# Altium project MIXR Regulators.PrjPcb (part 2 of 2)

## Sheet MIXR Power - Battery Management System.SchDoc: Title
size B; Organization: Midnight Sun Solar Rayce Car Team; Address1: University of Waterloo; Address2: 200 University Ave W; Address3: Waterloo, ON, Canada; Address4: N2L 3E9; Website: www.uwmidsun.com; ProjectName: ProjectName
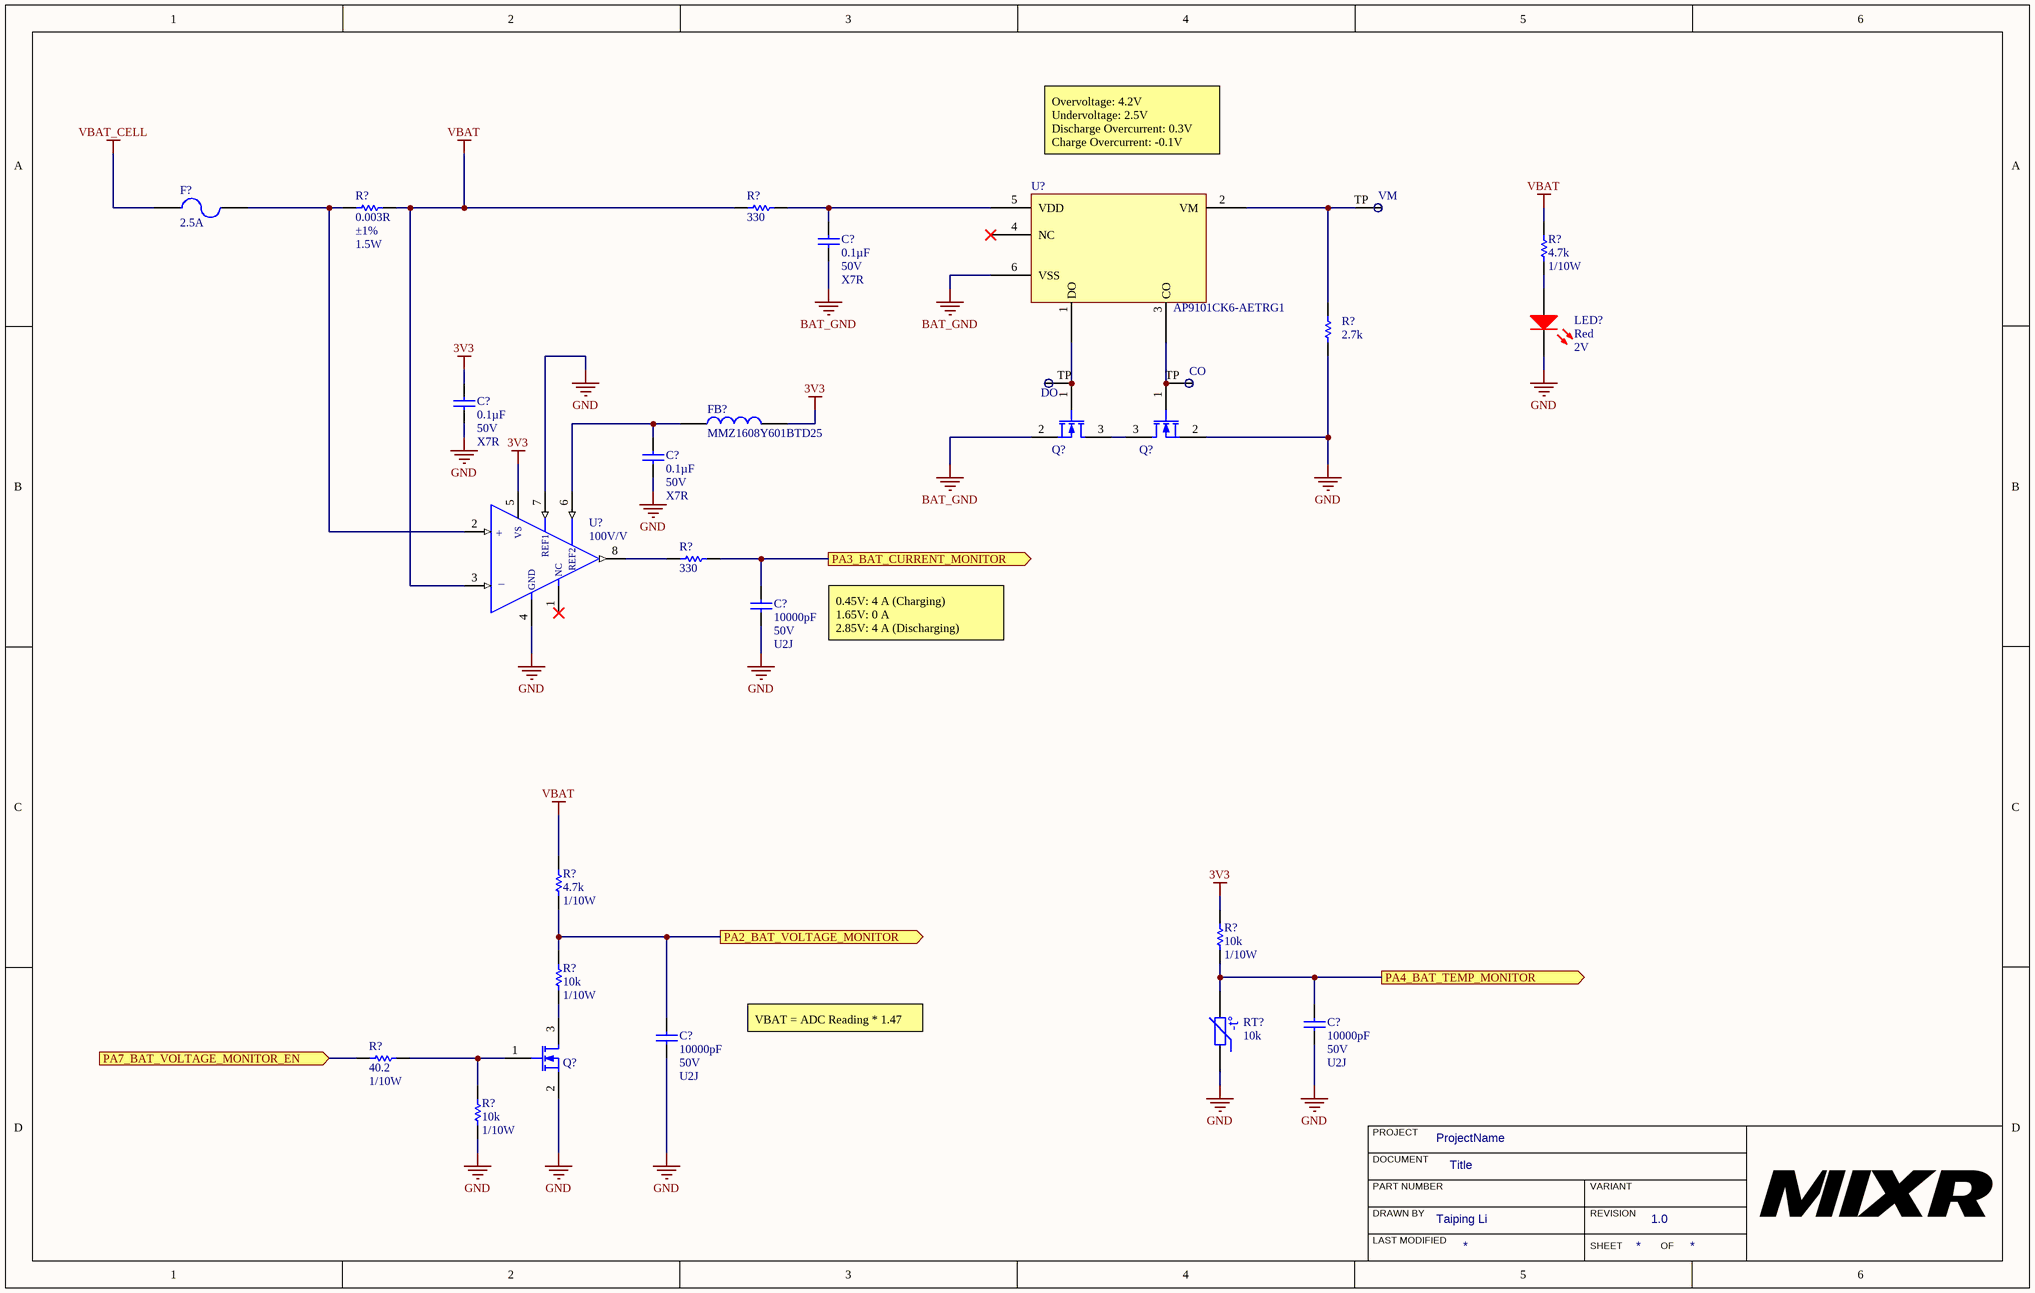
[diagram p2: MIXR Power - Battery Management System.SchDoc]

### Parts
(Parts that share a designator on the sheet are numbered #1, #2 ... from top to bottom, then left to right.)
C?#7  Capacitance: 0.1µF  Voltage: 50V  Temperature Coefficient: X7R  [CAP, 0603]  (hidden comment: CAP CER 0.1UF 50V 10% X7R 0603)
C?#8  Capacitance: 0.1µF  Voltage: 50V  Temperature Coefficient: X7R  [CAP, 0603]  (hidden comment: CAP CER 0.1UF 50V 10% X7R 0603)
C?#9  Capacitance: 0.1µF  Voltage: 50V  Temperature Coefficient: X7R  [CAP, 0603]  (hidden comment: CAP CER 0.1UF 50V 10% X7R 0603)
C?#10  Capacitance: 10000pF  Voltage: 50V  Temperature Coefficient: U2J  [CAP, 0603]  (hidden comment: CAP CER 10nF 50V 5% X7R 0603)
C?#11  Capacitance: 10000pF  Voltage: 50V  Temperature Coefficient: U2J  [CAP, 0603]  (hidden comment: CAP CER 10nF 50V 5% X7R 0603)
C?#12  Capacitance: 10000pF  Voltage: 50V  Temperature Coefficient: U2J  [CAP, 0603]  (hidden comment: CAP CER 10nF 50V 5% X7R 0603)
CO  Test Point  [Test Point]  (value not drawn)  (no BOM)
DO  Test Point  [Test Point]  (value not drawn)  (no BOM)
F?  Current Rating: 2.5A  [FUSE LITTLEFUSE 0466 1206]  (hidden comment: FUSE 2.5A 32VDC 1206)
FB?  Manufacturer Part Number: MMZ1608Y601BTD25  [FB 0603]  (hidden comment: FB 600 OHM 1LN 0603)
LED?  Color: Red  Voltage - Forward (Vf) (Typ): 2V  [LED_0603]  (hidden comment: LED RED CLEAR 2V 0603)
Q?#1  MOSFET N-CH 30V 6.2A 0.9W SOT-23  [MOSFET N-CH 30V 6.2A 0.9W SOT-23]  (value not drawn)
Q?#2  MOSFET N-CH 30V 6.2A 0.9W SOT-23  [MOSFET N-CH 30V 6.2A 0.9W SOT-23]  (value not drawn)
Q?#3  MOSFET N-CH 30V 6.2A 0.9W SOT-23  [MOSFET N-CH 30V 6.2A 0.9W SOT-23]  (value not drawn)
R?#7  Resistance (Ohms): 0.003R  Tolerance: ±1%  Power (Watts): 1.5W  [RES 2010]  (hidden comment: RES 0.003 OHM 1% 1.5W 2010)
R?#8  value 330  [RES, 0603]  (hidden comment: RES 330 OHM 1% 1/10W 0603)
R?#9  Resistance (Ohms): 4.7k  Power (Watts): 1/10W  [RES, 0603]  (hidden comment: RES 4.7K OHM 1% 1/10W 0603)
R?#10  2.7k  [RES, 0603]
R?#11  value 330  [RES, 0603]  (hidden comment: RES 330 OHM 1% 1/10W 0603)
R?#12  Resistance (Ohms): 4.7k  Power (Watts): 1/10W  [RES, 0603]  (hidden comment: RES 4.7K OHM 1% 1/10W 0603)
R?#13  Resistance: 10k  Power: 1/10W  [RES, 0603]  (hidden comment: RES 10K OHM 1% 1/10W 0603)
R?#14  Resistance: 10k  Power: 1/10W  [RES, 0603]  (hidden comment: RES 10K OHM 1% 1/10W 0603)
R?#15  Resistance: 40.2  Power: 1/10W  [RES, 0603]  (hidden comment: RES 40.2 OHM 0.5% 1/10W 0603)
R?#16  Resistance: 10k  Power: 1/10W  [RES, 0603]  (hidden comment: RES 10K OHM 1% 1/10W 0603)
RT?  Resistance in Ohms @ 25°C: 10k  [RES, 0603]  (hidden comment: NTC THERMISTORS 10K 0603 SMD)
U?#3  Manufacturer Part Number: AP9101CK6-AETRG1  [SOT23-6]  (hidden comment: IC BATT PROT LI-ION 1-CELL SOT26)
U?#4  100V/V  [IC CURRENT AMPLIFIER INA240 TSSOP-8]
VM  Test Point  [Test Point]  (value not drawn)  (no BOM)

### Ports
PA2_BAT_VOLTAGE_MONITOR (out), PA3_BAT_CURRENT_MONITOR (out), PA4_BAT_TEMP_MONITOR (out), PA7_BAT_VOLTAGE_MONITOR_EN (in)

### Nets
3V3: C?#8.1 FB?.2 R?#13.1 U?#4.5(VS)
BAT_GND: C?#7.2 Q?#1.2(S) U?#3.6(VSS)
GND: C?#8.2 C?#9.2 C?#10.2 C?#11.2 C?#12.2 LED?.2(K) Q?#2.2(S) Q?#3.2(S) R?#10.2 R?#16.2 RT?.1 U?#4.4(GND) U?#4.7(REF1)
VBAT: R?#7.2 R?#8.1 R?#9.1 R?#12.1 U?#4.3(-IN)
VBAT_CELL: F?.1
NetC?#7_1: C?#7.1 R?#8.2 U?#3.5(VDD)
NetC?#9_1: C?#9.1 FB?.1 U?#4.6(REF2)
NetC?#10_1: C?#10.1 R?#11.2 ; port PA3_BAT_CURRENT_MONITOR
NetC?#11_1: C?#11.1 R?#13.2 RT?.2 ; port PA4_BAT_TEMP_MONITOR
NetC?#12_1: C?#12.1 R?#12.2 R?#14.1 ; port PA2_BAT_VOLTAGE_MONITOR
NetCO_TP: CO.TP Q?#2.1(G) U?#3.3(CO)
NetDO_TP: DO.TP Q?#1.1(G) U?#3.1(DO)
NetF?_2: F?.2 R?#7.1 U?#4.2(+IN)
NetLED?_1: LED?.1(A) R?#9.2
NetQ?#1_3: Q?#1.3(D) Q?#2.3(D)
NetQ?#3_1: Q?#3.1(G) R?#15.2 R?#16.1
NetQ?#3_3: Q?#3.3(D) R?#14.2
NetR?#10_1: R?#10.1 U?#3.2(VM) VM.TP
NetR?#11_1: R?#11.1 U?#4.8(OUTPUT)
NetR?#15_1: R?#15.1 ; port PA7_BAT_VOLTAGE_MONITOR_EN

Not connected (* = marked no-connect by the designer): U?#3 4(NC)*; U?#4 1(NC)*

### Notes on the sheet
- Overvoltage: 4.2V
  Undervoltage: 2.5V
  Discharge Overcurrent: 0.3V
  Charge Overcurrent: -0.1V
- 0.45V: 4 A (Charging)
  1.65V: 0 A
  2.85V: 4 A (Discharging)
- VBAT = ADC Reading * 1.47
- PROJECT
- DOCUMENT
- DRAWN BY
- LAST MODIFIED
- PART NUMBER
- REVISION
- SHEET
- VARIANT
- OF
- (in symbol IC CURRENT AMPLIFIER INA240 8-TSSOP) +; _
- (in symbol NTC THERMISTORS 10K 0603 SMD) -t°

### Library data of the parts
C?#7-C?#9 = CAP CER 0.1UF 50V 10% X7R 0603: 0.10µF ±10% 50V Ceramic Capacitor X7R 0603 (1608 Metric); Manufacturer 1: AVX Corporation; Manufacturer Part Number 1: 06035C104KAT2A; Supplier 1: Digi-Key; Supplier Part Number 1: 478-5052-1-ND; Packaging: Cut Tape (CT); Part Status: Active; Operating Temperature: -55°C ~ 125°C; Ratings: -; Mounting Type: Surface Mount, MLCC; Package / Case: 0603 (1608 Metric); Size / Dimension: 0.063" L x 0.032" W (1.60mm x 0.81mm); Height - Seated (Max): -; Thickness (Max): 0.035" (0.90mm); Lead Spacing: -; Lead Style: -; ComponentLink1URL: http://datasheets.avx.com/X7RDielectric.pdf; ComponentLink1Description: http://datasheets.avx.com/X7RDielectric.pdf; Tolerance: ±10%
C?#10-C?#12 = CAP CER 10nF 50V 5% X7R 0603: 10000pF ±5% 50V Ceramic Capacitor U2J 0603 (1608 Metric); Manufacturer 1: KEMET; Manufacturer Part Number 1: C0603C103J5JAC7867; Supplier 1: Digi-Key; Supplier Part Number 1: 399-13384-1-ND; Packaging: Cut Tape (CT); Part Status: Active; Operating Temperature: -55°C ~ 125°C; Ratings: -; Failure Rate: -; Mounting Type: Surface Mount, MLCC; Package / Case: 0603 (1608 Metric); Size / Dimension: 0.063" L x 0.032" W (1.60mm x 0.80mm); Height - Seated (Max): -; Thickness (Max): 0.034" (0.87mm); Lead Spacing: -; Lead Style: -; ComponentLink1URL: http://www.kemet.com/docfinder?Partnumber=C0603C103J5JAC7867; ComponentLink1Description: http://www.kemet.com/docfinder?Partnumber=C0603C103J5JAC7867; Tolerance: ±5%
F? = FUSE 2.5A 32VDC 1206: 2.5A 32V AC 32V DC Fuse Board Mount (Cartridge Style Excluded) Surface Mount 1206 (3216 Metric); Manufacturer 1: Littelfuse; Manufacturer Part Number 1: 046602.5NRHF; DC Cold Resistance: 24mR; Power Dissipation: 192.5mW; Approvals: UL; Supplier 1: Digi-Key; Stock 1: 4995; Pricing 1: 1=0.84000, 5=0.81200, 10=0.78700, 50=0.66180, 100=0.54930, 250=0.49940, 500=0.42450, 1000=0.37455 (USD); RoHS: Yes; Mount: Surface Mount; Case/Package: 1206; Case Code (Metric): 3216; Case Code (Imperial): 1206; Housing Material: Ceramic; Min Operating Temperature: -55°C; Max Operating Temperature: 90°C; Package Quantity: 5000; Voltage Rating (AC): 32V; Voltage Rating (DC): 32V; Packaging: Tape and Reel; Working Voltage: 32V; Fuse Type: Board Mount (Cartridge Style Excluded); Length: 3.18mm; Height: 0.023inch; Width: 0.06inch; Depth: 1.52mm; Lead Free: Lead Free; ComponentLink1URL: https://datasheet.ciiva.com/303/littelfuse-fuse-466-303217.pdf?src-supplier=Digi-Key; ComponentLink1Description: https://datasheet.ciiva.com/303/littelfuse-fuse-466-303217.pdf?src-supplier=Digi-Key; ComponentLink2URL: https://datasheet.ciiva.com/18652/littelfuse-fuse-466-datasheet-pdf-18652469.pdf?src-supplier=Digi-Key; ComponentLink2Description: https://datasheet.ciiva.com/18652/littelfuse-fuse-466-datasheet-pdf-18652469.pdf?src-supplier=Digi-Key; ComponentLink3URL: https://datasheet.ciiva.com/16327/littelfuse-fuse-466-16327471.pdf?src-supplier=Future+Electronics; ComponentLink3Description: https://datasheet.ciiva.com/16327/littelfuse-fuse-466-16327471.pdf?src-supplier=Future+Electronics; Supplier Part Number 1: F6143CT-ND
FB? = FB 600 OHM 1LN 0603: FERRITE BEAD 600 OHM 0603 1LN; Manufacturer: TDK; Number of Lines: 1; Max Current Rating: 500mA; DC Resistance (DCR): 400mR; Impedance: 600R; Tolerance: 25%; Test Frequency: 100MHz; Supplier 1: Digi-Key; Supplier Part Number 1: 445-172850-1-ND; RoHS: Yes; Stock 1: 19540; Pricing 1: 1 = 0.10000, 10 = 0.07600, 25 = 0.06840, 50 = 0.05000, 100 = 0.04330, 250 = 0.03416, 500 = 0.02884, 1000 = 0.02429 (USD); Mount: Surface Mount; Case/Package: 0603; Weight: 7.1E-05oz; Case Code (Metric): 1608; Case Code (Imperial): 0603; Min Operating Temperature: -55°C; Max Operating Temperature: 125°C; Package Quantity: 4000; Packaging: Tape and Reel; Termination: SMD/SMT; Max DC Current: 500mA; Length: 0.063inch; Height: 0.037inch; Width: 0.031inch; Ratings: AEC-Q200
LED? = LED RED CLEAR 2V 0603: Red 631nm LED Indication - Discrete 2V 0603 (1608 Metric); Manufacturer: Wurth Electronics Inc.; Manufacturer Part Number: 150060RS75000; Lens Color: Colorless; Millicandela Rating: 250mcd; Lens Style/Size: Rectangle with Flat Top, 1.10mm x 0.70mm; Current - Test: 20mA; Viewing Angle: 140°; Wavelength - Dominant: 625nm; Wavelength - Peak: 630nm; Supplier 1: Digi-Key; RoHS: RoHS Compliant; Category: Optoelectronics; Stock 1: 35521; Pricing 1: 1=0.21, 100=0.1617, 500=0.13964 (CAD); Packaging: Cut Tape (CT); Part Status: Active; Lens Transparency: Clear; Mounting Type: Surface Mount; Features: -; Package / Case: 0603 (1608 Metric); Supplier Device Package: 0603; Size / Dimension: 1.60mm L x 0.80mm W; Height (Max): 0.80mm; ComponentLink1URL: http://katalog.we-online.de/led/datasheet/150060RS75000.pdf; ComponentLink1Description: http://katalog.we-online.de/led/datasheet/150060RS75000.pdf; Supplier Part Number 1: 732-4978-1-ND
Q?#1-Q?#3 = MOSFET N-CH 30V 6.2A 0.9W SOT-23: N-Channel 30V 6.2A (Ta) 900mW (Ta) Surface Mount SOT-23; Manufacturer: Diodes; Manufacturer Part Number: DMN3023L-7; Rds On Max: 25mR; Input Capacitance: 873pF; Supplier 1: Digi-Key; Stock 1: 38246; Pricing 1: 1=0.47, 10=0.368, 100=0.2529, 500=0.1734, 1000=0.1301 (USD); Mount: Surface Mount; Case/Package: TO-236-3; Min Operating Temperature: -55°C; Max Operating Temperature: 150°C; Packaging: Tape and Reel; Drain to Source Voltage (Vdss): 30V; Continuous Drain Current (ID): 6.2A; Max Power Dissipation: 900mW; ComponentLink1URL: https://www.diodes.com/assets/Datasheets/DMN3023L.pdf; ComponentLink1Description: https://www.diodes.com/assets/Datasheets/DMN3023L.pdf; ComponentLink2URL: http://www.mouser.com/ds/2/115/DMN3023L-959533.pdf; ComponentLink2Description: http://www.mouser.com/ds/2/115/DMN3023L-959533.pdf; Supplier Part Number 1: DMN3023L-7DICT-ND
R?#7 = RES 0.003 OHM 1% 1.5W 2010: 0.003 Ohm ±1% 1.5W Chip Resistor 2010 (5025 Metric) Current Sense, Moisture Resistant Metal Foil; Manufacturer 1: Stackpole Electronics Inc.; Manufacturer Part Number 1: CSNL2010FT3L00; Description 1: RES SMD 0.003 OHM 1% 1.5W 2010; Temperature Coefficient: ±50ppm/°C; Supplier 1: Digi-Key; Supplier Part Number 1: CSNL2010FT3L00CT-ND; RoHS: RoHS Compliant; Category: Resistors; Stock 1: 18532; Pricing 1: 1=1.02, 10=0.844, 25=0.7232, 50=0.6508, 100=0.5665, 250=0.5062, 500=0.4098, 1000=0.33145 (CAD); Packaging: Cut Tape (CT); Part Status: Active; Composition: Metal Foil; Features: Current Sense, Moisture Resistant; Operating Temperature: -55°C ~ 170°C; Package / Case: 2010 (5025 Metric); Supplier Device Package: 2010; Size / Dimension: 0.200" L x 0.100" W (5.08mm x 2.54mm); Height - Seated (Max): 0.041" (1.04mm); Failure Rate: -; ComponentLink1URL: https://www.seielect.com/Catalog/SEI-csnl.pdf; ComponentLink1Description: https://www.seielect.com/Catalog/SEI-csnl.pdf
R?#8 R?#11 = RES 330 OHM 1% 1/10W 0603: 330 Ohms ±1% 0.1W, 1/10W Chip Resistor 0603 (1608 Metric) Automotive AEC-Q200, Moisture Resistant Thick Film; Manufacturer: TE Connectivity; Manufacturer Part Number: CRGCQ0603F330R; Supplier 1: Digi-Key; Supplier Part Number 1: A129682CT-ND; RoHS: No; Stock 1: 87700; Pricing 1: 1 = 0.10000, 10 = 0.03300, 100 = 0.01320, 1000 = 0.00595, 2500 = 0.00516 (USD); ComponentLink1URL: http://www.te.com/commerce/DocumentDelivery/DDEController?Action=srchrtrv&DocNm=1773204-3&DocType=DS&DocLang=English&src-supplier=Digi-Key; ComponentLink1Description: http://www.te.com/commerce/DocumentDelivery/DDEController?Action=srchrtrv&DocNm=1773204-3&DocType=DS&DocLang=English&src-supplier=Digi-Key; ComponentLink2URL: https://www.te.com/commerce/DocumentDelivery/DDEController?Action=srchrtrv&DocNm=1773204-3&DocType=DS&DocLang=English&src-supplier=Digi-Key; ComponentLink2Description: https://www.te.com/commerce/DocumentDelivery/DDEController?Action=srchrtrv&DocNm=1773204-3&DocType=DS&DocLang=English&src-supplier=Digi-Key
R?#9 R?#12 = RES 4.7K OHM 1% 1/10W 0603: 4.7k Ohm ±1% 0.1W, 1/10W Chip Resistor 0603 (1608 Metric) Moisture Resistant Thick Film; Manufacturer 1: Yageo; Manufacturer Part Number 1: RC0603FR-074K7L; Description 1: RES SMD 4.7K OHM 1% 1/10W 0603; Temperature Coefficient: ±100ppm/°C; Supplier 1: Digi-Key; Supplier Part Number 1: 311-4.70KHRCT-ND; RoHS: RoHS Compliant; Category: Resistors; Stock 1: 3487566; Pricing 1: 1=0.16, 10=0.022, 100=0.0089, 1000=0.00402, 2500=0.00349 (CAD); Packaging: Cut Tape (CT); Part Status: Active; Composition: Thick Film; Features: Moisture Resistant; Operating Temperature: -55°C ~ 155°C; Package / Case: 0603 (1608 Metric); Supplier Device Package: 0603; Size / Dimension: 0.063" L x 0.031" W (1.60mm x 0.80mm); Height - Seated (Max): 0.022" (0.55mm); Failure Rate: -; ComponentLink1URL: http://www.yageo.com/documents/recent/PYu-RC_Group_51_RoHS_L_7.pdf; ComponentLink1Description: http://www.yageo.com/documents/recent/PYu-RC_Group_51_RoHS_L_7.pdf; Tolerance: ±1%
R?#10 = RES 2.7K OHM 1% 1/10W 0603: 2.7 kOhms ±1% 0.1W, 1/10W Chip Resistor 0603 (1608 Metric) Automotive AEC-Q200, Moisture Resistant Thick Film; Manufacturer: TE Connectivity; Manufacturer Part Number: CRGCQ0603F2K7; Supplier 1: Digi-Key; Supplier Part Number 1: A129693CT-ND; RoHS: No; Stock 1: 137187; Pricing 1: 1 = 0.10000, 10 = 0.03300, 100 = 0.01320, 1000 = 0.00595, 2500 = 0.00516 (USD); ComponentLink1URL: http://www.te.com/commerce/DocumentDelivery/DDEController?Action=srchrtrv&DocNm=1773204-3&DocType=DS&DocLang=English&src-supplier=Digi-Key; ComponentLink1Description: http://www.te.com/commerce/DocumentDelivery/DDEController?Action=srchrtrv&DocNm=1773204-3&DocType=DS&DocLang=English&src-supplier=Digi-Key; ComponentLink2URL: https://www.te.com/commerce/DocumentDelivery/DDEController?Action=srchrtrv&DocNm=1773204-3&DocType=DS&DocLang=English&src-supplier=Digi-Key; ComponentLink2Description: https://www.te.com/commerce/DocumentDelivery/DDEController?Action=srchrtrv&DocNm=1773204-3&DocType=DS&DocLang=English&src-supplier=Digi-Key
R?#13 R?#14 R?#16 = RES 10K OHM 1% 1/10W 0603: RES SMD 10K OHM 1% 1/10W 0603; Manufacturer 1: Yageo; Manufacturer Part Number 1: RC0603FR-0710KL; Temperature Coefficient: ±100ppm/°C; Supplier 1: Digi-Key; Supplier Part Number 1: 311-10.0KHRCT-ND; Packaging: Cut Tape (CT); Part Status: Active; Composition: Thick Film; Operating Temperature: -55°C ~ 155°C; Package / Case: 0603 (1608 Metric); Supplier Device Package: 0603; Size / Dimension: 0.063" L x 0.031" W (1.60mm x 0.80mm); Height - Seated (Max): 0.022" (0.55mm); Failure Rate: -; ComponentLink1URL: http://www.yageo.com/documents/recent/PYu-RC_Group_51_RoHS_L_7.pdf; ComponentLink1Description: http://www.yageo.com/documents/recent/PYu-RC_Group_51_RoHS_L_7.pdf; Tolerance: ±1%
R?#15 = RES 40.2 OHM 0.5% 1/10W 0603: RES SMD 40.2 OHM 0.5% 1/10W 0603; Manufacturer 1: Yageo; Manufacturer Part Number 1: RT0603DRE0740R2L; Temperature Coefficient: ±50ppm/°C; Supplier 1: Digi-Key; Supplier Part Number 1: 311-2576-1-ND; Packaging: Cut Tape (CT); Part Status: Active; Composition: Thin Film; Operating Temperature: -55°C ~ 155°C; Package / Case: 0603 (1608 Metric); Supplier Device Package: 0603; Size / Dimension: 0.063" L x 0.031" W (1.60mm x 0.80mm); Height - Seated (Max): 0.022" (0.55mm); Failure Rate: -; ComponentLink1URL: http://www.yageo.com/documents/recent/PYu-RT_1-to-0.01_RoHS_L_7.pdf; ComponentLink1Description: http://www.yageo.com/documents/recent/PYu-RT_1-to-0.01_RoHS_L_7.pdf; Tolerance: ±0.5%
RT? = NTC THERMISTORS 10K 0603 SMD: NTC THERMISTORS 10KOHM 1608 SMD; Manufacturer: Murata Electronics North America; Manufacturer Part Number: NCU18XH103F60RB; Resistance Tolerance: ±1%; B25/50: 3380K; B25/85: 3434K; B25/100: 3455K; Supplier 1: Digi-Key; RoHS: Request Inventory Verification; Category: Sensors, Transducers; Stock 1: 0; Pricing 1: 4000=0.06771, 8000=0.05974, 12000=0.05775, 20000=0.05675, 28000=0.05576 (CAD); Packaging: Tape & Reel (TR); Part Status: Active; B Value Tolerance: ±1%; B0/50: -; B25/75: -; Operating Temperature: -40°C ~ 125°C; Length - Lead Wire: -; Mounting Type: Surface Mount; Package / Case: 0603 (1608 Metric); ComponentLink1URL: https://www.murata.com/~/media/webrenewal/support/library/catalog/products/thermistor/r03e.ashx; ComponentLink1Description: https://www.murata.com/~/media/webrenewal/support/library/catalog/products/thermistor/r03e.ashx; Supplier Part Number 1: 490-16279-2-ND
U?#3 = IC BATT PROT LI-ION 1-CELL SOT26: Battery Battery Protection IC Lithium Ion/Polymer SOT-26; Manufacturer: Diodes; Number of Cells: 1; Fault Protection: Over Current; Supplier 1: Digi-Key; Supplier Part Number 1: AP9101CK6-AETRG1DICT-ND; Stock 1: 5917; Pricing 1: 1 = 0.45000, 10 = 0.36300, 100 = 0.24720, 500 = 0.18540, 1000 = 0.13905 (USD); RoHS: Yes; Case/Package: SOT-23-6; Min Operating Temperature: -40°C; Max Operating Temperature: 85°C; ComponentLink1URL: https://www.diodes.com/assets/Datasheets/AP9101C.pdf?src-supplier=Digi-Key; ComponentLink1Description: https://www.diodes.com/assets/Datasheets/AP9101C.pdf?src-supplier=Digi-Key
U?#4 = IC CURRENT AMPLIFIER INA240 8-TSSOP: Current Sense Amplifier 1 Circuit 8-TSSOP; Manufacturer 1: Texas Instruments; Manufacturer Part Number 1: INA240A3PWR; Description 1: IC AMP CURRENT SENSE 8-TSSOP; Slew Rate: 2 V/µs; Current - Supply: 1.8mA; Voltage - Supply, Single/Dual (±): 2.7 V ~ 5.5 V; Supplier 1: Digi-Key; Supplier Part Number 1: 296-45090-1-ND; RoHS: RoHS Compliant; Category: Integrated Circuits (ICs); Stock 1: 1286; Pricing 1: 1=3.79, 10=3.397, 100=2.7311, 500=2.24388, 1000=1.85921 (CAD); Packaging: Cut Tape (CT); Part Status: Active; Amplifier Type: Current Sense; Output Type: -; Operating Temperature: -40°C ~ 125°C; Mounting Type: Surface Mount; Package / Case: 8-TSSOP (0.173", 4.40mm Width); Supplier Device Package: 8-TSSOP; ComponentLink1URL: http://www.ti.com/lit/ds/symlink/ina240.pdf; ComponentLink1Description: http://www.ti.com/lit/ds/symlink/ina240.pdf

## Nets that join several sheets
3V3: MIXR Regulators - Regulators (C?#3.1 C?#4.1 R?#5.1 U?#2.8), MIXR Power - Battery Charging (R23.1 R25.1 R26.1), MIXR Power - Battery Management System (C?#8.1 FB?.2 R?#13.1 U?#4.5)
GND: MIXR Regulators - Regulators (17 pins), MIXR Power - Battery Charging (12 pins), MIXR Power - Battery Management System (13 pins)
VBAT: MIXR Power - Battery Charging (C20.1 U5.13 U5.14), MIXR Power - Battery Management System (5 pins)
VBAT_PROT: MIXR Regulators - Regulators (R?#1.1), MIXR Power - Battery Charging (5 pins)